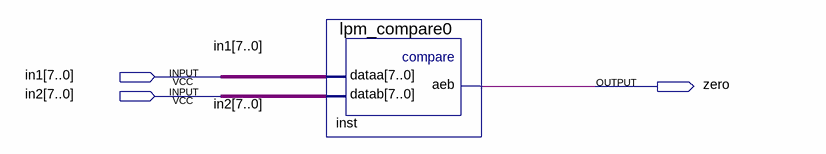
[diagram p0: schematic sheet]
// Quartus schematic equalb8.bdf as structural Verilog: 1 symbols, 3 pins
module equalb8 (
  input  [7:0] in1,
  input  [7:0] in2,
  output zero
);

  lpm_compare0 inst (.dataa(in1), .datab(in2), .aeb(zero));
endmodule
